# Altium schematic sheet SPWM.SchDoc
size A4
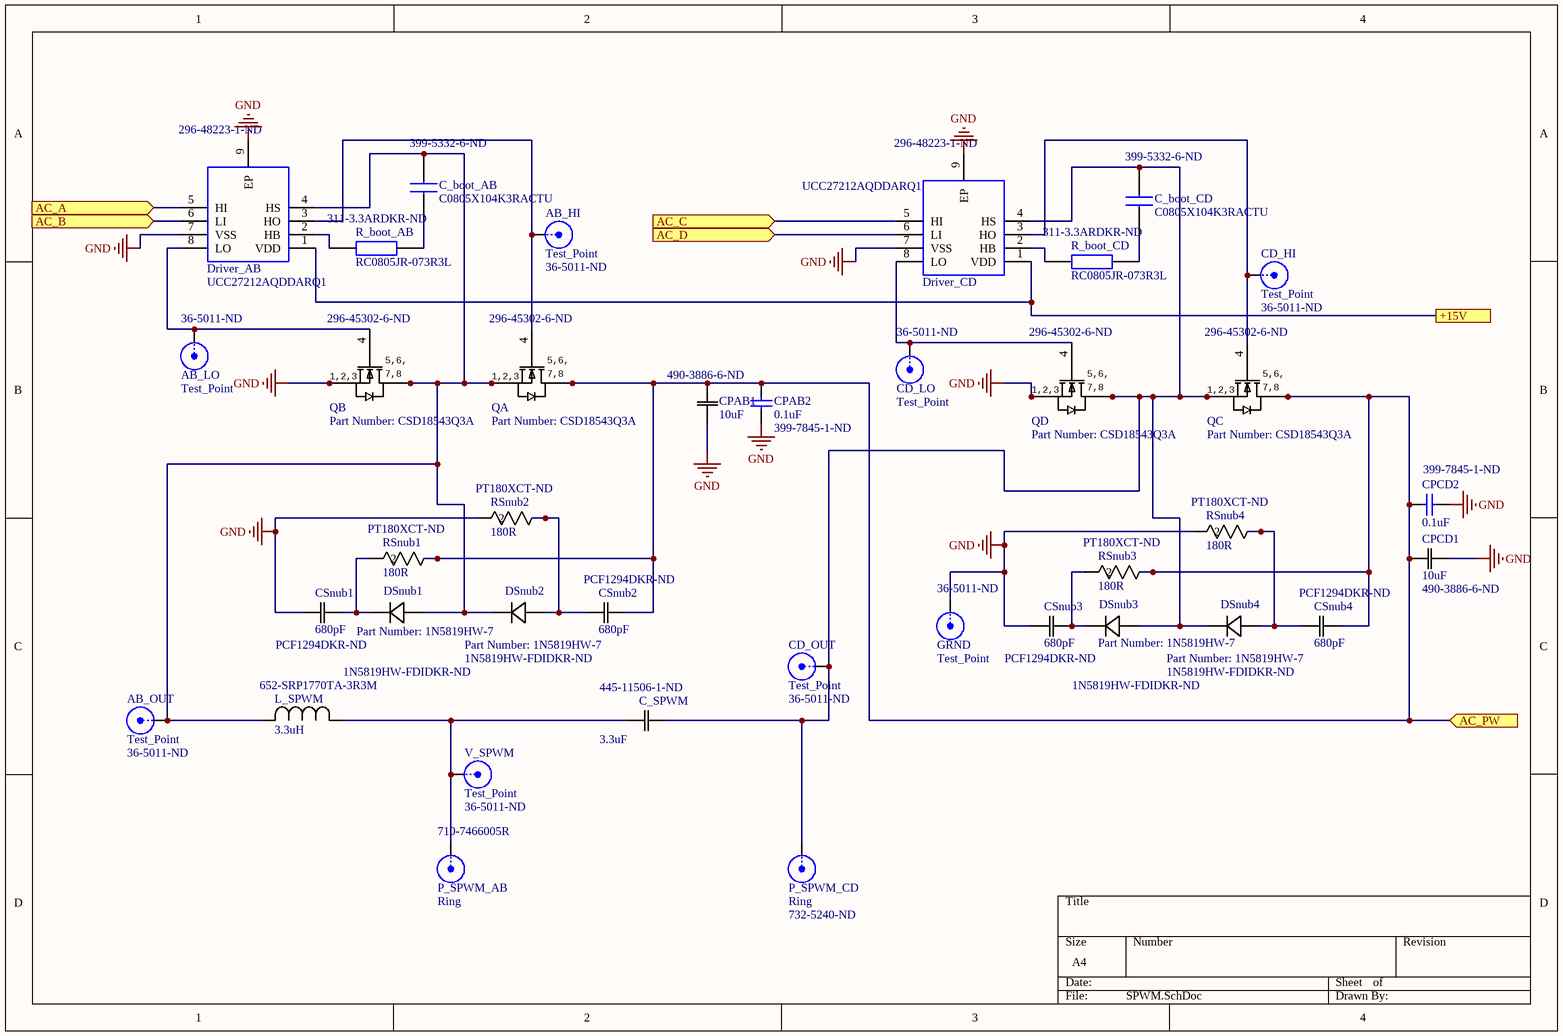
[diagram p0: SPWM.SchDoc]

## Parts
AB_HI  Test_Point  Supplier Part Number 1: 36-5011-ND  [5011]
AB_LO  Test_Point  Supplier Part Number 1: 36-5011-ND  [5011]
AB_OUT  Test_Point  Supplier Part Number 1: 36-5011-ND  [5011]
C_boot_AB  C0805X104K3RACTU  Supplier Part Number 1: 399-5332-6-ND  [CAPC2012X98N]
C_boot_CD  C0805X104K3RACTU  Supplier Part Number 1: 399-5332-6-ND  [CAPC2012X98N]
C_SPWM  3.3uF  Supplier Part Number 1: 445-11506-1-ND  [CAP_2012]
CD_HI  Test_Point  Supplier Part Number 1: 36-5011-ND  [5011]
CD_LO  Test_Point  Supplier Part Number 1: 36-5011-ND  [5011]
CD_OUT  Test_Point  Supplier Part Number 1: 36-5011-ND  [5011]
CPAB1  10uF  Supplier Part Number 1: 490-3886-6-ND  [G-21]
CPAB2  0.1uF  Supplier Part Number 1: 399-7845-1-ND  [1608[0603]]
CPCD1  10uF  Supplier Part Number 1: 490-3886-6-ND  [G-21]
CPCD2  0.1uF  Supplier Part Number 1: 399-7845-1-ND  [1608[0603]]
CSnub1  680pF  Supplier Part Number 1: PCF1294DKR-ND  [CAP_J1]
CSnub2  680pF  Supplier Part Number 1: PCF1294DKR-ND  [CAP_J1]
CSnub3  680pF  Supplier Part Number 1: PCF1294DKR-ND  [CAP_J1]
CSnub4  680pF  Supplier Part Number 1: PCF1294DKR-ND  [CAP_J1]
Driver_AB  UCC27212AQDDARQ1  Supplier Part Number 1: 296-48223-1-ND  [SOIC127P600X170-9N]
Driver_CD  UCC27212AQDDARQ1  Supplier Part Number 1: 296-48223-1-ND  [SOIC127P600X170-9N]
DSnub1  Part Number: 1N5819HW-7  Supplier Part Number 1: 1N5819HW-FDIDKR-ND  [SOD123]
DSnub2  Part Number: 1N5819HW-7  Supplier Part Number 1: 1N5819HW-FDIDKR-ND  [SOD123]
DSnub3  Part Number: 1N5819HW-7  Supplier Part Number 1: 1N5819HW-FDIDKR-ND  [SOD123]
DSnub4  Part Number: 1N5819HW-7  Supplier Part Number 1: 1N5819HW-FDIDKR-ND  [SOD123]
GRND  Test_Point  Supplier Part Number 1: 36-5011-ND  [5011]
L_SPWM  3.3uH  Supplier Part Number 1: 652-SRP1770TA-3R3M  [IND_TA-101M]
P_SPWM_AB  Ring  Supplier Part Number 1: 710-7466005R  [7466005R]
P_SPWM_CD  Ring  Supplier Part Number 1: 732-5240-ND  [7466005R]
QA  Part Number: CSD18543Q3A  Supplier Part Number 1: 296-45302-6-ND  [DNH0008AT]
QB  Part Number: CSD18543Q3A  Supplier Part Number 1: 296-45302-6-ND  [DNH0008AT]
QC  Part Number: CSD18543Q3A  Supplier Part Number 1: 296-45302-6-ND  [DNH0008AT]
QD  Part Number: CSD18543Q3A  Supplier Part Number 1: 296-45302-6-ND  [DNH0008AT]
R_boot_AB  RC0805JR-073R3L  Supplier Part Number 1: 311-3.3ARDKR-ND  [RESC2012X60N]
R_boot_CD  RC0805JR-073R3L  Supplier Part Number 1: 311-3.3ARDKR-ND  [RESC2012X60N]
RSnub1  180R  Supplier Part Number 1: PT180XCT-ND  [RC2512N]
RSnub2  180R  Supplier Part Number 1: PT180XCT-ND  [RC2512N]
RSnub3  180R  Supplier Part Number 1: PT180XCT-ND  [RC2512N]
RSnub4  180R  Supplier Part Number 1: PT180XCT-ND  [RC2512N]
V_SPWM  Test_Point  Supplier Part Number 1: 36-5011-ND  [5011]

## Ports
+15V, AC_A (in), AC_B (in), AC_C (in), AC_D (in), AC_PW (in)

## Nets
GND: CPAB1.1 CPAB2.1 CPCD1.1 CPCD2.1 CSnub1.1 CSnub3.1 Driver_AB.7(VSS) Driver_AB.9(EP) Driver_CD.7(VSS) Driver_CD.9(EP) GRND.1(X) QB.1(S) QB.2(S) QB.3(S) QD.1(S) QD.2(S) QD.3(S) RSnub2.2 RSnub4.2
+15V: Driver_AB.1(VDD) Driver_CD.1(VDD) ; port +15V
AC_A: Driver_AB.5(HI) ; port AC_A
AC_B: Driver_AB.6(LI) ; port AC_B
AC_C: Driver_CD.5(HI) ; port AC_C
AC_D: Driver_CD.6(LI) ; port AC_D
AC_PW: CPAB1.2 CPAB2.2 CPCD1.2 CPCD2.2 CSnub2.2 CSnub4.2 QA.5(D) QA.6(D) QA.7(D) QA.8(D) QA.9(D) QC.5(D) QC.6(D) QC.7(D) QC.8(D) QC.9(D) RSnub1.1 RSnub3.1 ; port AC_PW
NetAB_HI_1: AB_HI.1(X) Driver_AB.3(HO) QA.4(G)
NetAB_LO_1: AB_LO.1(X) Driver_AB.8(LO) QB.4(G)
NetAB_OUT_1: AB_OUT.1(X) C_boot_AB.2 Driver_AB.4(HS) DSnub1.2 DSnub2.1 L_SPWM.2 QA.1(S) QA.2(S) QA.3(S) QB.5(D) QB.6(D) QB.7(D) QB.8(D) QB.9(D)
NetC_boot_AB_1: C_boot_AB.1 R_boot_AB.2
NetC_boot_CD_1: C_boot_CD.1 R_boot_CD.2
NetC_boot_CD_2: C_boot_CD.2 C_SPWM.2 CD_OUT.1(X) Driver_CD.4(HS) DSnub3.2 DSnub4.1 P_SPWM_CD.1(X) QC.1(S) QC.2(S) QC.3(S) QD.5(D) QD.6(D) QD.7(D) QD.8(D) QD.9(D)
NetC_SPWM_1: C_SPWM.1 L_SPWM.1 P_SPWM_AB.1(X) V_SPWM.1(X)
NetCD_HI_1: CD_HI.1(X) Driver_CD.3(HO) QC.4(G)
NetCD_LO_1: CD_LO.1(X) Driver_CD.8(LO) QD.4(G)
NetCSnub1_2: CSnub1.2 DSnub1.1 RSnub1.2
NetCSnub2_1: CSnub2.1 DSnub2.2 RSnub2.1
NetCSnub3_2: CSnub3.2 DSnub3.1 RSnub3.2
NetCSnub4_1: CSnub4.1 DSnub4.2 RSnub4.1
NetDriver_AB_2: Driver_AB.2(HB) R_boot_AB.1
NetDriver_CD_2: Driver_CD.2(HB) R_boot_CD.1

## Notes on the sheet
- (in symbol CSD18543Q3A) 5,6,; 1,2,3; 7,8

## Library data of the parts
AB_HI AB_LO AB_OUT CD_HI CD_LO CD_OUT GRND V_SPWM = BNC: Manufacturer: Keystone Electronics; Body Material: PBT; Gender: Female; Number of Ports: 1; Inside Diameter: 1.78mm; Hole Diameter: 1.6mm; Supplier 1: Digi-Key; Manufacturer Part Number: 5011; Stock 1: 84156; Pricing 1: 1=0.35, 25=0.308, 100=0.3015, 250=0.28304, 500=0.2523, 1000=0.1714, 2500=0.15296, 5000=0.1434, 10000=0.13384 (USD); Mount: PCB,Through Hole; Color: Black; Contact Material: Bronze; Contact Plating: Silver,Tin; Material: Nylon,Bronze,Silver; Housing Color: Black; Package Quantity: 100; Packaging: Bulk; Orientation: Straight; Length: 11.3mm; Lead Free: Lead Free; REACH SVHC: No SVHC; Flammability Rating: UL94 V-0; ComponentLink1URL: http://www.farnell.com/datasheets/1703983.pdf?src-supplier=Element14; ComponentLink1Description: http://www.farnell.com/datasheets/1703983.pdf?src-supplier=Element14; ComponentLink2URL: http://www.keyelco.com/product-pdf.cfm?p=1320&src-supplier=Digi-Key; ComponentLink2Description: http://www.keyelco.com/product-pdf.cfm?p=1320&src-supplier=Digi-Key; ComponentLink3URL: http://www.keyelco.com/userAssets/file/M60-2p60.pdf?src-supplier=Future+Electronics; ComponentLink3Description: http://www.keyelco.com/userAssets/file/M60-2p60.pdf?src-supplier=Future+Electronics; ComponentLink4URL: http://uk.rs-online.com/webdocs/1416/0900766b814167b6.pdf?src-supplier=RSComponents; ComponentLink4Description: http://uk.rs-online.com/webdocs/1416/0900766b814167b6.pdf?src-supplier=RSComponents
C_boot_AB C_boot_CD = C0805X104K3RACTU: Multilayer Ceramic Capacitors MLCC - SMD/SMT 25V 0.1uF 10%; Manufacturer_Name: Kemet; Geometry.Height: 0.98mm; Capacitance: 100nF; Dielectric: X7R; Manufacturer_Part_Number: C0805X104K3RACTU; RS Part Number: *; RS Price/Stock: *; Arrow Part Number: C0805X104K3RACTU; Arrow Price/Stock: https://www.arrow.com/en/products/c0805x104k3ractu/kemet-corporation; Datasheet Link: https://content.kemet.com/datasheets/KEM_C1013_X7R_FT-CAP_SMD.pdf; Supplier 1: Digi-Key; Manufacturer: KEMET; Manufacturer Part Number: C0805X104K3RACTU; Stock 1: 11605; Pricing 1: 1=0.56, 10=0.396, 100=0.2608, 500=0.1932, 1000=0.16422 (USD); Mount: Surface Mount; Case/Package: 0805; Case Code (Metric): 2012; Case Code (Imperial): 0805; Dielectric Material: Ceramic; Min Operating Temperature: -55°C; Max Operating Temperature: 125°C; Package Quantity: 1; Voltage Rating: 25V; Tolerance: 10%; Packaging: Tape and Reel; Voltage Rating (DC): 25V; Termination: SMD/SMT; Features: Soft Termination; Length: 0.083inch; Width: 0.049inch; Thickness: 0.035inch; ComponentLink1URL: https://search.kemet.com/component-edge/download/datasheet/C0805X104K3RACTU.pdf?src-supplier=Digi-Key; ComponentLink1Description: https://search.kemet.com/component-edge/download/datasheet/C0805X104K3RACTU.pdf?src-supplier=Digi-Key; ComponentLink2URL: http://components.arrow.com/part/dataview/46130688S9875265N7429?src-supplier=Arrow; ComponentLink2Description: http://components.arrow.com/part/dataview/46130688S9875265N7429?src-supplier=Arrow; ComponentLink3URL: http://www.mouser.com/ds/2/212/KEM_C1013_X7R_FT-CAP_SMD-1103280.pdf?src-supplier=Mouser; ComponentLink3Description: http://www.mouser.com/ds/2/212/KEM_C1013_X7R_FT-CAP_SMD-1103280.pdf?src-supplier=Mouser; ComponentLink4URL: https://api.kemet.com/component-edge/download/datasheet/C0805X104K3RACTU.pdf?src-supplier=Digi-Key; ComponentLink4Description: https://api.kemet.com/component-edge/download/datasheet/C0805X104K3RACTU.pdf?src-supplier=Digi-Key
C_SPWM = C2012JB1H335K125: No Description Available; Manufacturer_Part_Number: C2012JB1H335K125AB; Vendor: TDK; Built_By: EMA_UL_Team; Dielectric Material: Ceramic; Tolerance: 10%; Voltage Rating: 50V; Copyright: Copyright (C) 2018 Accelerated Designs. All rights reserved; RefDes: RefDes; Type: DEV; Value: Value; Supplier 1: Digi-Key; Manufacturer: TDK; Manufacturer Part Number: C2012JB1H335K125AB; Stock 1: 4870; Pricing 1: 1=0.73, 10=0.519, 100=0.3416, 500=0.253, 1000=0.21505 (USD); Mount: Surface Mount; Case/Package: 0805; Case Code (Metric): 2012; Case Code (Imperial): 0805; Min Operating Temperature: -25°C; Max Operating Temperature: 85°C; Package Quantity: 2000; Packaging: Tape and Reel; Capacitance: 3.3uF; Termination: SMD/SMT; Composition: Ceramic; Voltage Rating (DC): 50V; Length: 0.079inch; Height: 1.25mm; Width: 0.049inch; Thickness: 0.057inch; Lead Free: Lead Free; ComponentLink1URL: https://product.tdk.com/en/products/common/pdf/mlcc_partnumber_description.pdf?src-supplier=Digi-Key; ComponentLink1Description: https://product.tdk.com/en/products/common/pdf/mlcc_partnumber_description.pdf?src-supplier=Digi-Key; ComponentLink2URL: https://product.tdk.com/info/en/catalog/spec/mlccspec_commercial_general_midvoltage_en.pdf?src-supplier=Digi-Key; ComponentLink2Description: https://product.tdk.com/info/en/catalog/spec/mlccspec_commercial_general_midvoltage_en.pdf?src-supplier=Digi-Key
CPAB1 CPCD1 = GRM21BR61C106KE1: No Description Available; Manufacturer_Part_Number: GRM21BR61C106KE15L; Vendor: Murata; Tolerance: 10%; Voltage Rating: 16V; Dielectric: X5R; Copyright: Copyright (C) 2015 Accelerated Designs. All rights reserved; RefDes: RefDes; Type: DEV; Value: Value; Supplier 1: Digi-Key; Manufacturer: Murata; Manufacturer Part Number: GRM21BR61C106KE15L; Stock 1: 3742758; Pricing 1: 1=0.31, 10=0.215, 100=0.1221, 500=0.08618, 1000=0.07541 (USD); Mount: Surface Mount; Case/Package: 0805; Case Code (Imperial): 0805; Case Code (Metric): 2012; Material: Ceramic; Min Operating Temperature: -55°C; Max Operating Temperature: 85°C; Packaging: Tape and Reel; Package Quantity: 1; Termination: SMD/SMT; Capacitance: 10uF; Voltage Rating (DC): 16V; Voltage: 16V; Length: 2mm; Height: 1.25mm; Depth: 1.25mm; Width: 1.25mm; Thickness: 0.053inch; Radiation Hardening: No; REACH SVHC: No SVHC; Lead Free: Lead Free; ComponentLink1URL: http://search.murata.co.jp/Ceramy/image/img/A01X/G101/ENG/GRM21BR61C106KE15-01.pdf?src-supplier=Avnet; ComponentLink1Description: http://search.murata.co.jp/Ceramy/image/img/A01X/G101/ENG/GRM21BR61C106KE15-01.pdf?src-supplier=Avnet; ComponentLink2URL: http://psearch.en.murata.com/capacitor/product/GRM21BR61C106KE15%23.pdf?src-supplier=Avnet; ComponentLink2Description: http://psearch.en.murata.com/capacitor/product/GRM21BR61C106KE15%23.pdf?src-supplier=Avnet; ComponentLink3URL: http://components.arrow.com/part/dataview/43432906S7256579N2606?src-supplier=Arrow; ComponentLink3Description: http://components.arrow.com/part/dataview/43432906S7256579N2606?src-supplier=Arrow; ComponentLink4URL: http://www.farnell.com/datasheets/2048774.pdf?src-supplier=Element14; ComponentLink4Description: http://www.farnell.com/datasheets/2048774.pdf?src-supplier=Element14; ComponentLink5URL: http://www.farnell.com/datasheets/2048774.pdf?src-supplier=Newark; ComponentLink5Description: http://www.farnell.com/datasheets/2048774.pdf?src-supplier=Newark; ComponentLink6URL: http://search.murata.co.jp/Ceramy/image/img/A01X/G101/ENG/GRM21BR61C106KE15-01.pdf?src-supplier=Digi-Key; ComponentLink6Description: http://search.murata.co.jp/Ceramy/image/img/A01X/G101/ENG/GRM21BR61C106KE15-01.pdf?src-supplier=Digi-Key; ComponentLink7URL: http://www.produktinfo.conrad.com/datenblaetter/450000-474999/450891-da-01-de-VS_CHIP_KOND_0805_10_0_UF_10Pr_16_0V_X5R.pdf?src-supplier=Conrad; ComponentLink7Description: http://www.produktinfo.conrad.com/datenblaetter/450000-474999/450891-da-01-de-VS_CHIP_KOND_0805_10_0_UF_10Pr_16_0V_X5R.pdf?src-supplier=Conrad; ComponentLink8URL: http://www.produktinfo.conrad.com/datenblaetter/450000-474999/454607-da-01-en-VS_KONDENSATOR_0805.pdf?src-supplier=Conrad; ComponentLink8Description: http://www.produktinfo.conrad.com/datenblaetter/450000-474999/454607-da-01-en-VS_KONDENSATOR_0805.pdf?src-supplier=Conrad
CPAB2 CPCD2 = Cap Semi: Manufacturer: KEMET; Manufacturer Part Number: C0603C104M5RACTU; Dielectric Material: Ceramic; Capacitance: 100nF; Tolerance: 20%; Dielectric: X7R; Voltage Rating: 50V; Dissipation Factor: 2.5%; Supplier 1: Digi-Key; Stock 1: 4631395; Pricing 1: 1=0.1, 10=0.039, 100=0.0174, 500=0.0124, 1000=0.00974 (USD); Mount: Surface Mount,PCB; Case/Package: 0603; Case Code (Metric): 1608; Case Code (Imperial): 0603; Contact Plating: Tin,Matte; Min Operating Temperature: -55°C; Max Operating Temperature: 125°C; Package Quantity: 1; Packaging: Tape and Reel; Voltage Rating (DC): 50V; Termination: SMD/SMT; Length: 1.6mm; Height: 0.8mm; Width: 0.031inch; Thickness: 0.034inch; Lead Pitch: 0.7mm; Depth: 0.8mm; Radiation Hardening: No; REACH SVHC: No SVHC; ComponentLink1URL: http://www.farnell.com/datasheets/2746056.pdf?src-supplier=Element14; ComponentLink1Description: http://www.farnell.com/datasheets/2746056.pdf?src-supplier=Element14; ComponentLink2URL: http://www.mouser.com/ds/2/212/KEM_C1002_X7R_SMD-1102033.pdf?src-supplier=Mouser; ComponentLink2Description: http://www.mouser.com/ds/2/212/KEM_C1002_X7R_SMD-1102033.pdf?src-supplier=Mouser; ComponentLink3URL: https://www.verical.com/server-webapp/html/getDatasheet?partID=626892&src-supplier=Verical; ComponentLink3Description: https://www.verical.com/server-webapp/html/getDatasheet?partID=626892&src-supplier=Verical; ComponentLink4URL: http://components.arrow.com/part/dataview/40911037S8853915N7429?src-supplier=Arrow; ComponentLink4Description: http://components.arrow.com/part/dataview/40911037S8853915N7429?src-supplier=Arrow; ComponentLink5URL: http://capacitoredge.kemet.com/capedge2/DataSheet?pn=C0603C104M5RAC7867&src-supplier=Avnet; ComponentLink5Description: http://capacitoredge.kemet.com/capedge2/DataSheet?pn=C0603C104M5RAC7867&src-supplier=Avnet; ComponentLink6URL: http://capacitoredge.kemet.com/capedge2/DataSheet?pn=C0603C104M5RAC7867&src-supplier=Avnet+Asia; ComponentLink6Description: http://capacitoredge.kemet.com/capedge2/DataSheet?pn=C0603C104M5RAC7867&src-supplier=Avnet+Asia; ComponentLink7URL: http://www.farnell.com/datasheets/2746056.pdf?src-supplier=Farnell; ComponentLink7Description: http://www.farnell.com/datasheets/2746056.pdf?src-supplier=Farnell; ComponentLink8URL: http://www.farnell.com/datasheets/2746056.pdf?src-supplier=Newark; ComponentLink8Description: http://www.farnell.com/datasheets/2746056.pdf?src-supplier=Newark; ComponentLink9URL: https://api.kemet.com/component-edge/download/datasheet/C0603C104M5RACTU.pdf?src-supplier=Digi-Key; ComponentLink9Description: https://api.kemet.com/component-edge/download/datasheet/C0603C104M5RACTU.pdf?src-supplier=Digi-Key; ComponentLink10URL: http://www.alliedelec.com/m/d/6f3b5eb83d09db50ed28bdc730567b33.pdf?src-supplier=Allied+Electronics; ComponentLink10Description: http://www.alliedelec.com/m/d/6f3b5eb83d09db50ed28bdc730567b33.pdf?src-supplier=Allied+Electronics; ComponentLink11URL: http://www.farnell.com/datasheets/2315113.pdf?src-supplier=Newark; ComponentLink11Description: http://www.farnell.com/datasheets/2315113.pdf?src-supplier=Newark; ComponentLink12URL: http://www.farnell.com/datasheets/1828800.pdf?src-supplier=Newark; ComponentLink12Description: http://www.farnell.com/datasheets/1828800.pdf?src-supplier=Newark; ComponentLink13URL: http://components.arrow.com/part/dataview/0323_00313986?src-supplier=Arrow+Europe; ComponentLink13Description: http://components.arrow.com/part/dataview/0323_00313986?src-supplier=Arrow+Europe; ComponentLink14URL: https://www.verical.com/server-webapp/html/getDatasheet?partID=110138&src-supplier=Verical; ComponentLink14Description: https://www.verical.com/server-webapp/html/getDatasheet?partID=110138&src-supplier=Verical
CSnub1-CSnub4 = ECHU1H681GX5: No Description Available; Manufacturer Part Number: ECH-U1H681GX5; Vendor: Panasonic; Built_By: EMA_UL_Team; Dielectric Material: Polyphenylene; Tolerance: 2%; Dielectric: PPS; Voltage Rating: 50V; Life (Hours): 500Hour; Dissipation Factor: 0.6%; Insulation Resistance: 3GR; Manufacturer_Part_Number: ECHU1H681GX5; Copyright: Copyright (C) 2018 Accelerated Designs. All rights reserved; RefDes: RefDes; Type: DEV; Value: Value; Supplier 1: Digi-Key; Manufacturer: Panasonic; Stock 1: 4847; Pricing 1: 1=0.53, 10=0.372, 100=0.245, 500=0.18148, 1000=0.15426 (USD); Mount: Surface Mount,PCB; Case/Package: 0805; Number of Pins: 2; Case Code (Metric): 2012; Case Code (Imperial): 0805; Min Operating Temperature: -55°C; Max Operating Temperature: 125°C; Capacitance: 680pF; Voltage Rating (DC): 50V; Packaging: Tape and Reel; Package Quantity: 1; Termination: SMD/SMT; Voltage: 50V; Length: 2mm; Height: 0.9mm; Depth: 1.25mm; Width: 1.25mm; Height - Seated (Max): 0.043inch; Radiation Hardening: No; REACH SVHC: No SVHC; Lead Free: Lead Free; ComponentLink1URL: http://uk.rs-online.com/webdocs/0eaa/0900766b80eaa63b.pdf?src-supplier=RSComponents; ComponentLink1Description: http://uk.rs-online.com/webdocs/0eaa/0900766b80eaa63b.pdf?src-supplier=RSComponents; ComponentLink2URL: https://www.alliedelec.com/m/d/226097b98ac6d03c2616807d31f98c69.pdf?src-supplier=Allied+Electronics; ComponentLink2Description: https://www.alliedelec.com/m/d/226097b98ac6d03c2616807d31f98c69.pdf?src-supplier=Allied+Electronics; ComponentLink3URL: https://www.verical.com/server-webapp/html/getDatasheet?partID=124471&src-supplier=Verical; ComponentLink3Description: https://www.verical.com/server-webapp/html/getDatasheet?partID=124471&src-supplier=Verical; ComponentLink4URL: http://www.onlinecomponents.com/productFiles/mf-PSC/21abd0000ce13.pdf?src-supplier=Onlinecomponents.com; ComponentLink4Description: http://www.onlinecomponents.com/productFiles/mf-PSC/21abd0000ce13.pdf?src-supplier=Onlinecomponents.com; ComponentLink5URL: http://industrial.panasonic.com/www-data/pdf/ABD0000/ABD0000CE13.pdf?src-supplier=Avnet; ComponentLink5Description: http://industrial.panasonic.com/www-data/pdf/ABD0000/ABD0000CE13.pdf?src-supplier=Avnet
Driver_AB Driver_CD = UCC27212AQDDARQ1: Automotive, 120-V Boot, 4-A Peak, High-Frequency High-Side and Low-Side Driver; Manufacturer: Texas Instruments; Number of Channels: 2; Channel Type: Independent; Max Output Current: 4A; ComponentLink1URL: http://www.ti.com/lit/ds/symlink/ucc27212a-q1.pdf?src-supplier=Digi-Key; ComponentLink1Description: http://www.ti.com/lit/ds/symlink/ucc27212a-q1.pdf?src-supplier=Digi-Key; Supplier 1: Digi-Key; Manufacturer Part Number: UCC27212AQDDARQ1; Stock 1: 2500; Pricing 1: 1=4.25, 10=3.819, 25=3.6108, 100=2.9688, 250=2.66388, 500=2.56758, 1000=2.1343 (USD); Mount: Surface Mount; Number of Pins: 8; Min Operating Temperature: -40°C; Max Operating Temperature: 140°C; Packaging: Cut Tape; Number of Drivers: 2
DSnub1-DSnub4 = 1N5819HW-7: No Description Available; Manufacturer: Diodes; Manufacturer Part Number: 1N5819HW-7-F; Vendor: Diodes Inc; Built_By: EMA_UL_Team; Forward Current: 1A; Max Repetitive Reverse Voltage (Vrrm): 40V; Forward Voltage: 450mV; Peak Reverse Current: 50uA; Element Configuration: Single; Max Forward Surge Current (Ifsm): 25A; Polarity: Standard; Capacitance: 110pF; Max Power Dissipation: 450mW; Manufacturer_Part_Number: 1N5819HW-7; Copyright: Copyright (C) 2018 Accelerated Designs. All rights reserved; RefDes: RefDes; Type: DEV; Value: Value; Supplier 1: Digi-Key; Stock 1: 253413; Pricing 1: 1=0.45, 10=0.333, 100=0.1581, 500=0.12896, 1000=0.09568 (USD); Case/Package: SOD-123-2; Number of Pins: 2; Weight: 0.000353oz; Contact Plating: Tin,Matte; Min Operating Temperature: -65°C; Max Operating Temperature: 125°C; Packaging: Tape and Reel; Peak Non-Repetitive Surge Current: 25A; Package Quantity: 3000; Average Rectified Current: 1A; Termination: SMD/SMT; Voltage Rating (DC): 40V; Current Rating: 1A; Output Current: 1A; Max Reverse Voltage (DC): 40V; Length: 2.85mm; Height: 1.25mm; Width: 1.7mm; Radiation Hardening: No; Lead Free: Lead Free; REACH SVHC: No SVHC; ComponentLink1URL: http://www.diodes.com/datasheets/ds30217.pdf?src-supplier=Future+Electronics; ComponentLink1Description: http://www.diodes.com/datasheets/ds30217.pdf?src-supplier=Future+Electronics; ComponentLink2URL: https://www.diodes.com/assets/Datasheets/ds30217.pdf?src-supplier=Digi-Key; ComponentLink2Description: https://www.diodes.com/assets/Datasheets/ds30217.pdf?src-supplier=Digi-Key; ComponentLink3URL: http://www.farnell.com/datasheets/2238341.pdf?src-supplier=Element14; ComponentLink3Description: http://www.farnell.com/datasheets/2238341.pdf?src-supplier=Element14; ComponentLink4URL: http://www.jameco.com/Jameco/Products/ProdDS/1538419.pdf?src-supplier=Jameco; ComponentLink4Description: http://www.jameco.com/Jameco/Products/ProdDS/1538419.pdf?src-supplier=Jameco; ComponentLink5URL: http://www.farnell.com/datasheets/2238341.pdf?src-supplier=Avnet; ComponentLink5Description: http://www.farnell.com/datasheets/2238341.pdf?src-supplier=Avnet; ComponentLink6URL: http://www.farnell.com/datasheets/2238341.pdf?src-supplier=Avnet+Europe; ComponentLink6Description: http://www.farnell.com/datasheets/2238341.pdf?src-supplier=Avnet+Europe
L_SPWM = SRP1770TA-101M: No Description Available; Manufacturer: Bourns; Manufacturer Part Number: SRP1770TA-3R3M; Core Material: Carbonyl Powder; Current Rating: 28A; Saturation Current: 45A; Shielding: Shielded; DC Resistance (DCR): 3.9mR; Self Resonant Frequency: 17MHz; Test Frequency: 100kHz; Tolerance: 20%; Supplier 1: Mouser; Stock 1: 282; Pricing 1: 1=3.43, 5=3.3, 10=3.16, 25=2.87, 50=2.62, 100=2.07 (USD); Mount: Surface Mount; Case/Package: Nonstandard; Min Operating Temperature: -40°C; Max Operating Temperature: 150°C; Packaging: Cut Tape; Composition: Wirewound; Inductance: 3.3uH; RMS Current (Irms): 28A; Inductance Tolerance: 20%; Length: 0.666inch; Width: 0.666inch; Height - Seated (Max): 0.276inch; Ratings: AEC-Q200; REACH SVHC: No SVHC; ComponentLink1URL: http://www.farnell.com/datasheets/1955470.pdf?src-supplier=Element14; ComponentLink1Description: http://www.farnell.com/datasheets/1955470.pdf?src-supplier=Element14; ComponentLink2URL: http://www.bourns.com/docs/Product-Datasheets/SRP1770TA.pdf?src-supplier=Digi-Key; ComponentLink2Description: http://www.bourns.com/docs/Product-Datasheets/SRP1770TA.pdf?src-supplier=Digi-Key; ComponentLink3URL: http://www.farnell.com/datasheets/1955470.pdf?src-supplier=Farnell; ComponentLink3Description: http://www.farnell.com/datasheets/1955470.pdf?src-supplier=Farnell; ComponentLink4URL: https://www.bourns.com/docs/Product-Datasheets/SRP1770TA.pdf?src-supplier=Digi-Key; ComponentLink4Description: https://www.bourns.com/docs/Product-Datasheets/SRP1770TA.pdf?src-supplier=Digi-Key
P_SPWM_AB = BNC: Ring Connector; Manufacturer: Wurth Electronics; Current Rating: 70A; Thread Size: M5; ComponentLink1URL: https://katalog.we-online.de/em/datasheet/7466003.pdf?src-supplier=Digi-Key; ComponentLink1Description: https://katalog.we-online.de/em/datasheet/7466003.pdf?src-supplier=Digi-Key; ComponentLink2URL: https://katalog.we-online.de/em/datasheet/7466005R.pdf?src-supplier=Digi-Key; ComponentLink2Description: https://katalog.we-online.de/em/datasheet/7466005R.pdf?src-supplier=Digi-Key; Supplier 1: Mouser; Manufacturer Part Number: 7466005R; Stock 1: 2328; Pricing 1: 1=2.37, 10=1.98, 25=1.98, 50=1.74, 100=1.58, 250=1.58 (USD); Mount: Surface Mount; Contact Plating: Tin; Contact Material: Brass; Termination: Power
P_SPWM_CD = BNC: Ring Connector; Manufacturer: Wurth Electronics; Manufacturer Part Number: 7466003; Current Rating: 50A; Number of Contacts: 1; Thread Size: M3; LatestRevisionDate: 17-Jul-2002; LatestRevisionNote: Re-released for DXP Platform.; Publisher: Altium Limited; Supplier 1: Digi-Key; Stock 1: 937; Pricing 1: 1=2.48, 10=2.352, 50=2.128, 100=1.904, 500=1.725 (USD); Mount: Surface Mount; Number of Pins: 1; Contact Material: Brass; Contact Plating: Tin; Termination: Power; Package Quantity: 100; Length: 7mm; REACH SVHC: Unknown; ComponentLink1URL: https://katalog.we-online.de/em/datasheet/7466003.pdf?src-supplier=Digi-Key; ComponentLink1Description: https://katalog.we-online.de/em/datasheet/7466003.pdf?src-supplier=Digi-Key
QA QB QC QD = CSD18543Q3A: No Description Available; Vendor: Texas Instruments; Built_By: Texas_Instrument_Team; Value: 60V; VALUE_2: Value; Manufacturer_Part_Number: CSD18543Q3A; Copyright: Copyright (C) 2018 Accelerated Designs. All rights reserved; RefDes: RefDes; Type: DEV; Supplier 1: Digi-Key
R_boot_AB R_boot_CD = RC0805JR-073R3L: Thick Film Resistors - SMD 3.3 OHM 5%; Manufacturer_Name: YAGEO (PHYCOMP); Manufacturer: Yageo; Geometry.Height: 0.6mm; Resistance: 3.3R; Temperature Coefficient: 200ppm/°C; Power Rating: 125mW; Voltage Rating: 150V; Manufacturer_Part_Number: RC0805JR-073R3L; RS Part Number: *; RS Price/Stock: *; Arrow Part Number: RC0805JR-073R3L; Arrow Price/Stock: https://www.arrow.com/en/products/rc0805jr-073r3l/yageo; Datasheet Link: http://www.yageo.com/documents/recent/PYu-RC_Group_51_RoHS_L_9.pdf; Supplier 1: Digi-Key; Manufacturer Part Number: RC0805JR-073R3L; Stock 1: 1302618; Pricing 1: 1=0.1, 10=0.068, 100=0.0278, 1000=0.01251, 2500=0.01086 (USD); Case/Package: 0805; Contact Plating: Tin,Lead,Matte; Case Code (Metric): 2012; Case Code (Imperial): 0805; Min Operating Temperature: -55°C; Max Operating Temperature: 155°C; Tolerance: 5%; Composition: Thick Film; Package Quantity: 1; Packaging: Tape and Reel; Number of Terminations: 2; Termination: SMD/SMT; Military Standard: Not; Max Power Dissipation: 125mW; Voltage Rating (DC): 150V; Features: Moisture Resistant; Length: 0.079inch; Height: 0.024inch; Width: 0.049inch; Depth: 1.25mm; Radiation Hardening: No; Lead Free: Lead Free; ComponentLink1URL: http://www.yageo.com/documents/recent/PYu-RC_Group_51_RoHS_L_10.pdf?src-supplier=Digi-Key; ComponentLink1Description: http://www.yageo.com/documents/recent/PYu-RC_Group_51_RoHS_L_10.pdf?src-supplier=Digi-Key; ComponentLink2URL: http://www.mouser.com/ds/2/447/Yageo_08112016_RC0805-968729.pdf?src-supplier=Mouser; ComponentLink2Description: http://www.mouser.com/ds/2/447/Yageo_08112016_RC0805-968729.pdf?src-supplier=Mouser; ComponentLink3URL: http://www.yageo.ru/pdf/RC0805.pdf?src-supplier=Future+Electronics; ComponentLink3Description: http://www.yageo.ru/pdf/RC0805.pdf?src-supplier=Future+Electronics
RSnub1-RSnub4 = ERJ-1TYJ181U: No Description Available; Vendor: Panasonic; Built_By: EMA_UL_Team; Tolerance: 5%; Power Rating: 1W; Voltage Rating: 200V; Temperature Coefficient: 200ppm/°C; Voltage Rating (DC): 250V; Manufacturer_Part_Number: ERJ-1TYJ181U; Copyright: Copyright (C) 2018 Accelerated Designs. All rights reserved; RefDes: RefDes; Type: DEV; Value: Value; Supplier 1: Digi-Key; Manufacturer: Panasonic; Manufacturer Part Number: ERJ-1TYJ181U; Stock 1: 22154; Pricing 1: 1=0.46, 10=0.353, 100=0.1485, 1000=0.08194 (USD); Mount: Surface Mount; Case/Package: 2512; Case Code (Imperial): 2512; Case Code (Metric): 6432; Contact Plating: Tin; Min Operating Temperature: -55°C; Max Operating Temperature: 155°C; Resistance: 180R; Package Quantity: 1; Packaging: Tape and Reel; Composition: Thick Film; Number of Terminations: 2; Military Standard: Not; Max Power Dissipation: 1W; Features: Automotive AEC-Q200; Length: 6.4mm; Height: 0.028inch; Width: 3.2mm; Depth: 3.2mm; Radiation Hardening: No; REACH SVHC: No SVHC; Lead Free: Lead Free; ComponentLink1URL: http://industrial.panasonic.com/www-data/pdf/AOA0000/AOA0000CE1.pdf?src-supplier=Avnet; ComponentLink1Description: http://industrial.panasonic.com/www-data/pdf/AOA0000/AOA0000CE1.pdf?src-supplier=Avnet; ComponentLink2URL: http://industrial.panasonic.com/www-data/pdf/AOA0000/AOA0000CE1.pdf?src-supplier=Avnet+Europe; ComponentLink2Description: http://industrial.panasonic.com/www-data/pdf/AOA0000/AOA0000CE1.pdf?src-supplier=Avnet+Europe; ComponentLink3URL: http://www.farnell.com/datasheets/1678796.pdf?src-supplier=Element14; ComponentLink3Description: http://www.farnell.com/datasheets/1678796.pdf?src-supplier=Element14